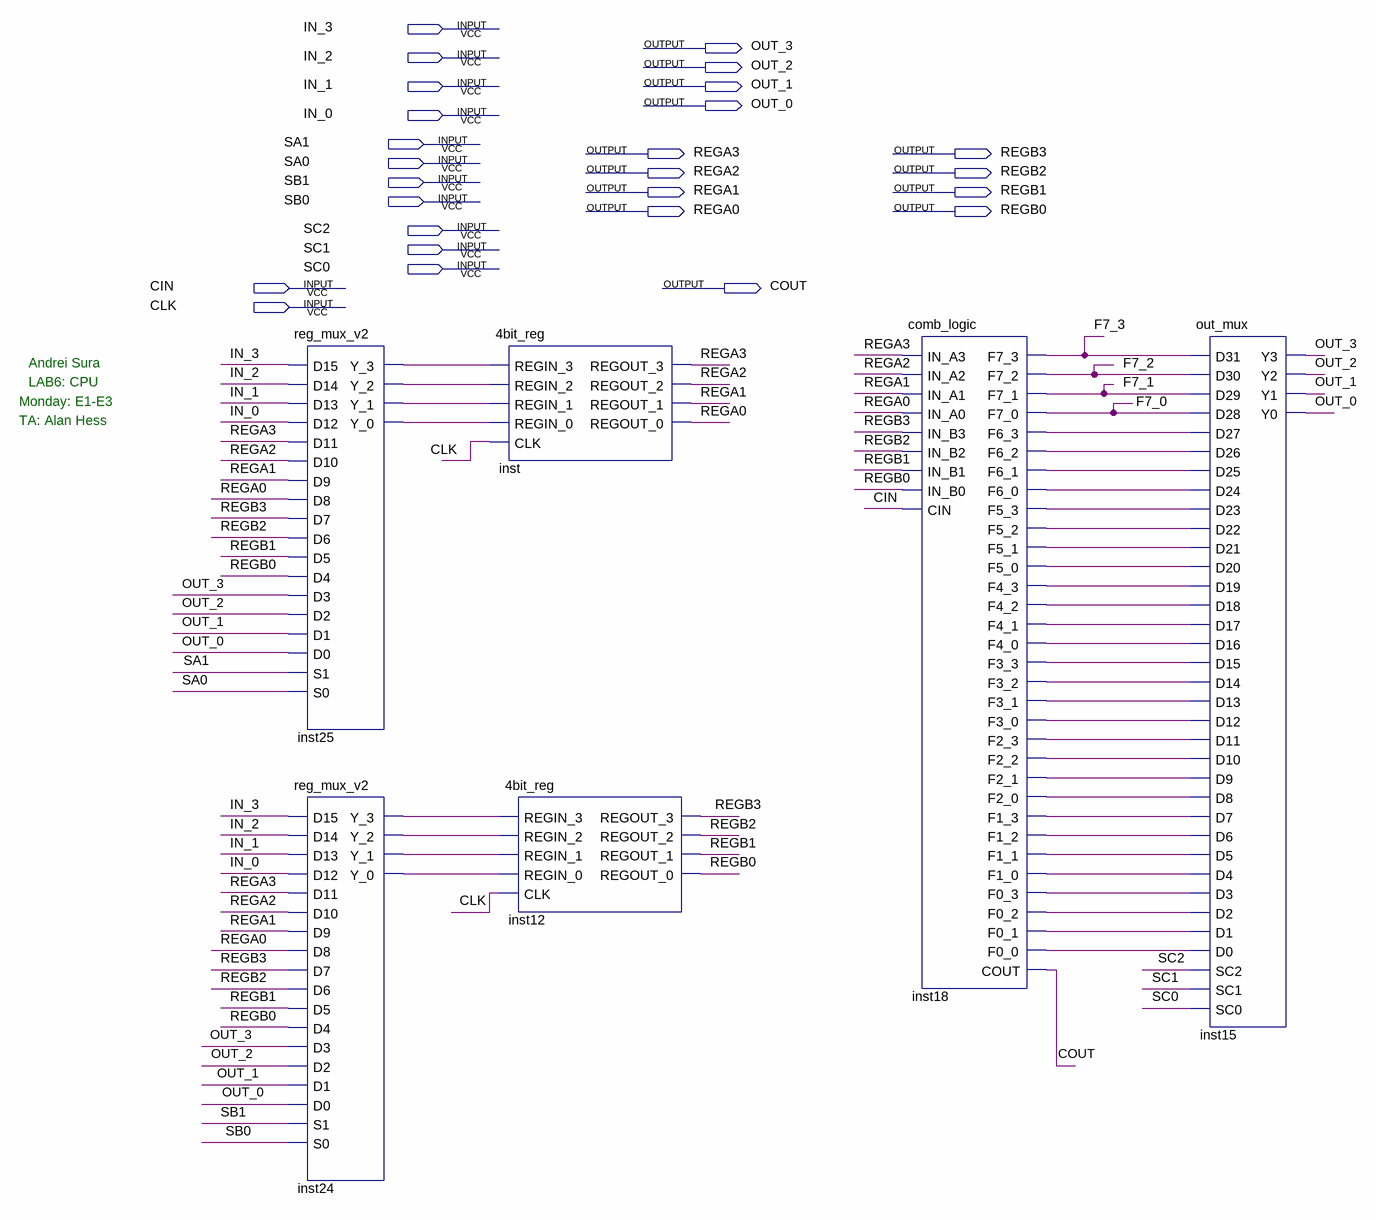
[diagram p0: schematic sheet]
// Quartus schematic lab6_cpu.bdf as structural Verilog: 6 symbols, 26 pins
module lab6_cpu (
  input  IN_3,
  input  IN_2,
  input  IN_1,
  input  IN_0,
  input  SA1,
  input  SA0,
  input  SB1,
  input  SB0,
  input  SC2,
  input  SC1,
  input  SC0,
  input  CIN,
  input  CLK,
  output OUT_3,
  output OUT_2,
  output OUT_1,
  output OUT_0,
  output REGA3,
  output REGB3,
  output REGA2,
  output REGB2,
  output REGA1,
  output REGB1,
  output REGA0,
  output REGB0,
  output COUT
);

  wire F7_0, F7_1, F7_2, F7_3, inst18_f0_0, inst18_f0_1, inst18_f0_2, inst18_f0_3, inst18_f1_0, inst18_f1_1,
       inst18_f1_2, inst18_f1_3, inst18_f2_0, inst18_f2_1, inst18_f2_2, inst18_f2_3, inst18_f3_0,
       inst18_f3_1, inst18_f3_2, inst18_f3_3, inst18_f4_0, inst18_f4_1, inst18_f4_2, inst18_f4_3,
       inst18_f5_0, inst18_f5_1, inst18_f5_2, inst18_f5_3, inst18_f6_0, inst18_f6_1, inst18_f6_2,
       inst18_f6_3, inst24_y_0, inst24_y_1, inst24_y_2, inst24_y_3, inst25_y_0, inst25_y_1, inst25_y_2,
       inst25_y_3;

  reg_mux_v2 inst25 (
    .D15(IN_3), .D14(IN_2), .D13(IN_1), .D12(IN_0), .D11(REGA3), .D10(REGA2), .D9(REGA1), .D8(REGA0),
    .D7(REGB3), .D6(REGB2), .D5(REGB1), .D4(REGB0), .D3(OUT_3), .D2(OUT_2), .D1(OUT_1), .D0(OUT_0), .S1(SA1),
    .S0(SA0), .Y_3(inst25_y_3), .Y_2(inst25_y_2), .Y_1(inst25_y_1), .Y_0(inst25_y_0));
  reg_mux_v2 inst24 (
    .D15(IN_3), .D14(IN_2), .D13(IN_1), .D12(IN_0), .D11(REGA3), .D10(REGA2), .D9(REGA1), .D8(REGA0),
    .D7(REGB3), .D6(REGB2), .D5(REGB1), .D4(REGB0), .D3(OUT_3), .D2(OUT_2), .D1(OUT_1), .D0(OUT_0), .S1(SB1),
    .S0(SB0), .Y_3(inst24_y_3), .Y_2(inst24_y_2), .Y_1(inst24_y_1), .Y_0(inst24_y_0));
  \4bit_reg  inst (
    .REGIN_3(inst25_y_3), .REGIN_2(inst25_y_2), .REGIN_1(inst25_y_1), .REGIN_0(inst25_y_0), .CLK(CLK),
    .REGOUT_3(REGA3), .REGOUT_2(REGA2), .REGOUT_1(REGA1), .REGOUT_0(REGA0));
  \4bit_reg  inst12 (
    .REGIN_3(inst24_y_3), .REGIN_2(inst24_y_2), .REGIN_1(inst24_y_1), .REGIN_0(inst24_y_0), .CLK(CLK),
    .REGOUT_3(REGB3), .REGOUT_2(REGB2), .REGOUT_1(REGB1), .REGOUT_0(REGB0));
  comb_logic inst18 (
    .IN_A3(REGA3), .IN_A2(REGA2), .IN_A1(REGA1), .IN_A0(REGA0), .IN_B3(REGB3), .IN_B2(REGB2), .IN_B1(REGB1),
    .IN_B0(REGB0), .CIN(CIN), .F7_3(F7_3), .F7_2(F7_2), .F7_1(F7_1), .F7_0(F7_0), .F6_3(inst18_f6_3),
    .F6_2(inst18_f6_2), .F6_1(inst18_f6_1), .F6_0(inst18_f6_0), .F5_3(inst18_f5_3), .F5_2(inst18_f5_2),
    .F5_1(inst18_f5_1), .F5_0(inst18_f5_0), .F4_3(inst18_f4_3), .F4_2(inst18_f4_2), .F4_1(inst18_f4_1),
    .F4_0(inst18_f4_0), .F3_3(inst18_f3_3), .F3_2(inst18_f3_2), .F3_1(inst18_f3_1), .F3_0(inst18_f3_0),
    .F2_3(inst18_f2_3), .F2_2(inst18_f2_2), .F2_1(inst18_f2_1), .F2_0(inst18_f2_0), .F1_3(inst18_f1_3),
    .F1_2(inst18_f1_2), .F1_1(inst18_f1_1), .F1_0(inst18_f1_0), .F0_3(inst18_f0_3), .F0_2(inst18_f0_2),
    .F0_1(inst18_f0_1), .F0_0(inst18_f0_0), .COUT(COUT));
  out_mux inst15 (
    .D31(F7_3), .D30(F7_2), .D29(F7_1), .D28(F7_0), .D27(inst18_f6_3), .D26(inst18_f6_2), .D25(inst18_f6_1),
    .D24(inst18_f6_0), .D23(inst18_f5_3), .D22(inst18_f5_2), .D21(inst18_f5_1), .D20(inst18_f5_0),
    .D19(inst18_f4_3), .D18(inst18_f4_2), .D17(inst18_f4_1), .D16(inst18_f4_0), .D15(inst18_f3_3),
    .D14(inst18_f3_2), .D13(inst18_f3_1), .D12(inst18_f3_0), .D11(inst18_f2_3), .D10(inst18_f2_2),
    .D9(inst18_f2_1), .D8(inst18_f2_0), .D7(inst18_f1_3), .D6(inst18_f1_2), .D5(inst18_f1_1),
    .D4(inst18_f1_0), .D3(inst18_f0_3), .D2(inst18_f0_2), .D1(inst18_f0_1), .D0(inst18_f0_0), .SC2(SC2),
    .SC1(SC1), .SC0(SC0), .Y3(OUT_3), .Y2(OUT_2), .Y1(OUT_1), .Y0(OUT_0));

  // Notes on the sheet:
  //   Andrei Sura
  //   LAB6: CPU
  //   Monday: E1-E3
  //   TA: Alan Hess
endmodule
